# Altium project Babadustov_A_O_Курсовой.PrjPcb
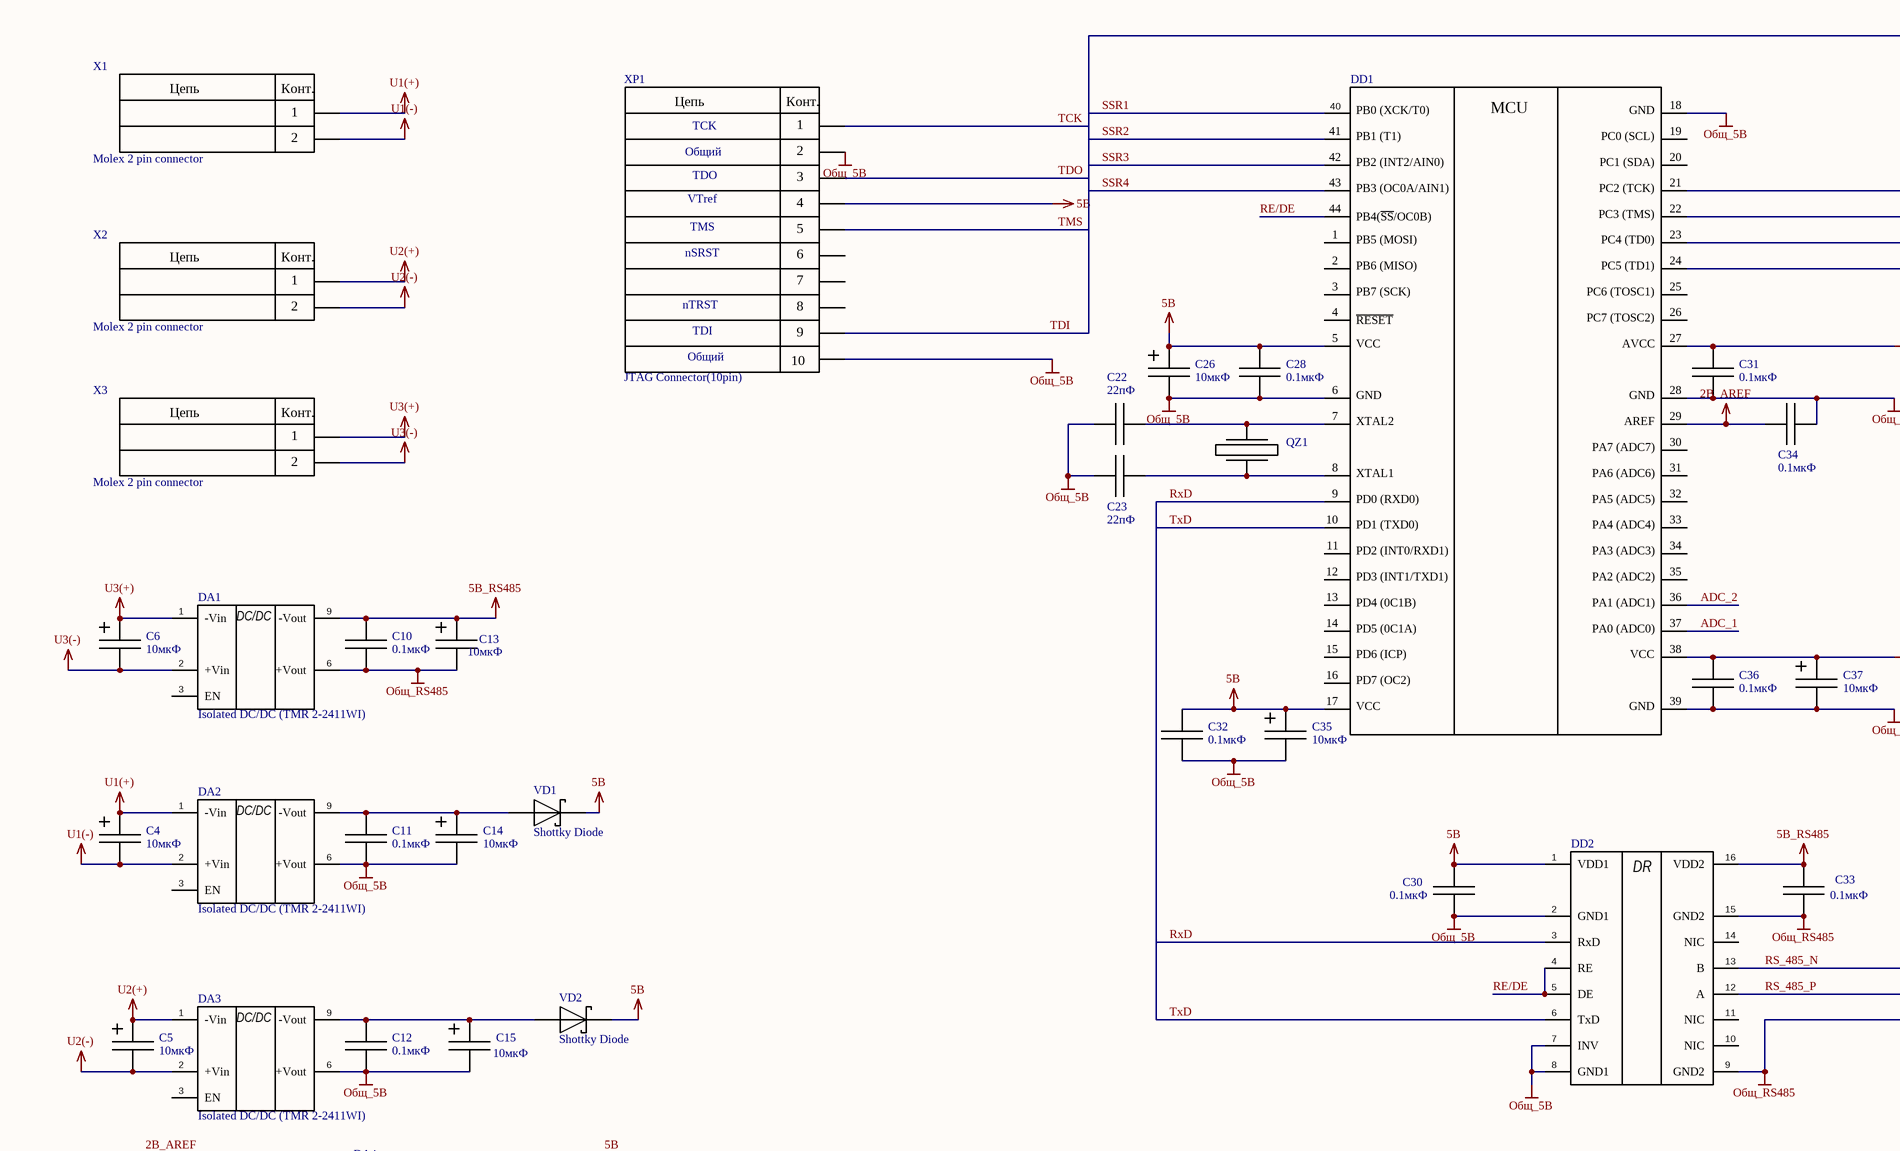
[diagram p0: Sheet1.SchDoc, top left]
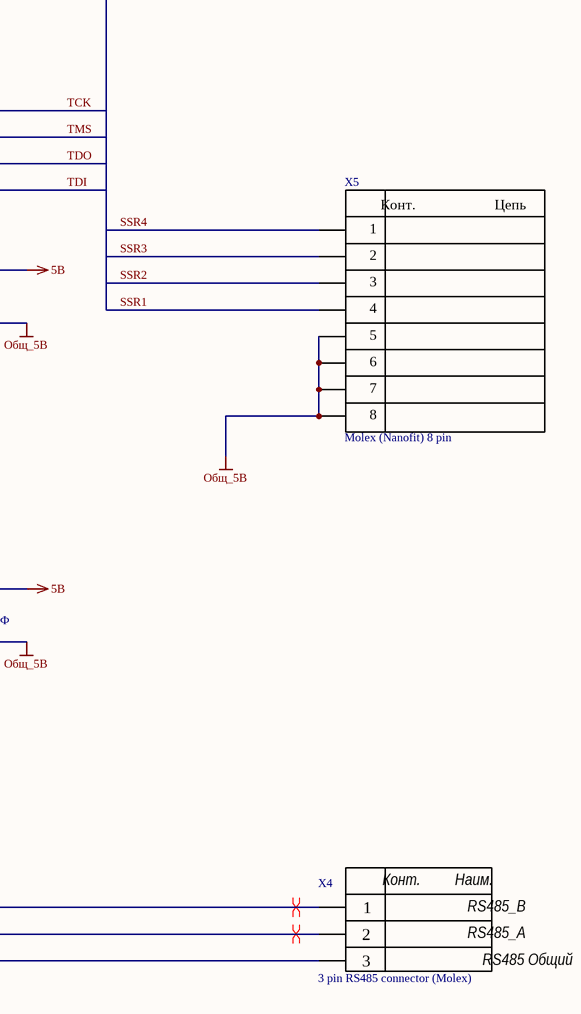
[diagram p1: Sheet1.SchDoc, top right]
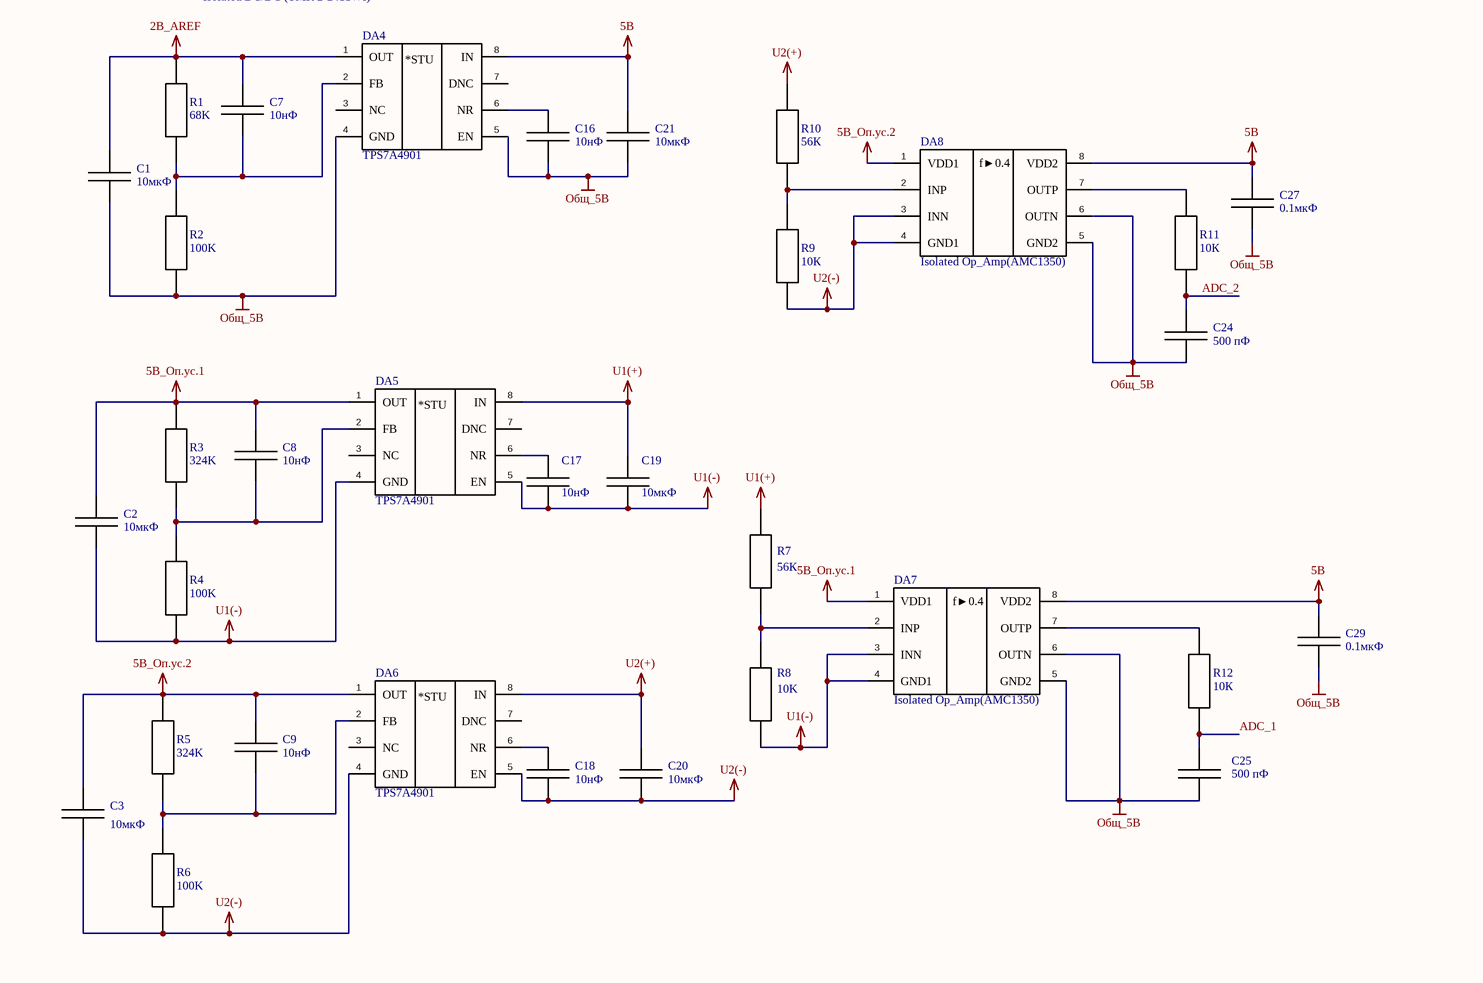
[diagram p2: Sheet1.SchDoc, bottom left]
1 sheet, 68 parts. Net scope: global (net labels, ports and power ports of the same name join across sheets).
Board file: PCB1.PcbDoc

## Sheet Sheet1.SchDoc
size 594 x 420 mm; SheetNumber: 1; SheetTotal: 1

### Parts
C1  CAP  [0805]  (value not drawn)
C2  CAP  [0805]  (value not drawn)
C3  CAP  [0805]  (value not drawn)
C4  CAP  [Cap pol 4x5.4]  (value not drawn)
C5  CAP  [Cap pol 4x5.4]  (value not drawn)
C6  CAP  [Cap pol 4x5.4]  (value not drawn)
C7  CAP  [0805]  (value not drawn)
C8  CAP  [0805]  (value not drawn)
C9  CAP  [0805]  (value not drawn)
C10  CAP  [0805]  (value not drawn)
C11  CAP  [0805]  (value not drawn)
C12  CAP  [0805]  (value not drawn)
C13  CAP  [Cap pol 4x5.4]  (value not drawn)
C14  CAP  [Cap pol 4x5.4]  (value not drawn)
C15  CAP  [Cap pol 4x5.4]  (value not drawn)
C16  CAP  [0805]  (value not drawn)
C17  CAP  [0805]  (value not drawn)
C18  CAP  [0805]  (value not drawn)
C19  CAP  [0805]  (value not drawn)
C20  CAP  [0805]  (value not drawn)
C21  CAP  [0805]  (value not drawn)
C22  CAP  [0805]  (value not drawn)
C23  CAP  [0805]  (value not drawn)
C24  CAP  [0805]  (value not drawn)
C25  CAP  [0805]  (value not drawn)
C26  CAP  [Cap pol 4x5.4]  (value not drawn)
C27  CAP  [0805]  (value not drawn)
C28  CAP  [0805]  (value not drawn)
C29  CAP  [0805]  (value not drawn)
C30  CAP  [0805]  (value not drawn)
C31  CAP  [0805]  (value not drawn)
C32  CAP  [0805]  (value not drawn)
C33  CAP  [0805]  (value not drawn)
C34  CAP  [0805]  (value not drawn)
C35  CAP  [Cap pol 4x5.4]  (value not drawn)
C36  CAP  [0805]  (value not drawn)
C37  CAP  [Cap pol 4x5.4]  (value not drawn)
DA1  Isolated DC/DC (TMR 2-2411WI)  [SIP-9]
DA2  Isolated DC/DC (TMR 2-2411WI)  [SIP-9]
DA3  Isolated DC/DC (TMR 2-2411WI)  [SIP-9]
DA4  TPS7A4901  [HVSSOP-8]
DA5  TPS7A4901  [HVSSOP-8]
DA6  TPS7A4901  [HVSSOP-8]
DA7  Isolated Op_Amp(AMC1350)  [SOIC-8]
DA8  Isolated Op_Amp(AMC1350)  [SOIC-8]
DD1  Atmega164PA  [TQFP-44]  (value not drawn)
DD2  Isolated RS485 Tranciever(ADM2461E)  [SSOP-16]  (value not drawn)
QZ1  Quartz rez  [XTAL]  (value not drawn)
R1  68K  [0805]
R2  100K  [0805]
R3  324K  [0805]
R4  100K  [0805]
R5  324K  [0805]
R6  100K  [0805]
R7  56К  [0805]
R8  10K  [0805]
R9  10К  [0805]
R10  56К  [0805]
R11  10К  [0805]
R12  10К  [0805]
VD1  Shottky Diode  [SMC]
VD2  Shottky Diode  [SMC]
X1  Molex 2 pin connector  [MolexMicroFit 2x1]
X2  Molex 2 pin connector  [MolexMicroFit 2x1]
X3  Molex 2 pin connector  [MolexMicroFit 2x1]
X4  3 pin RS485 connector (Molex)  [MolexMicroFit 3x1]
X5  Molex (Nanofit) 8 pin  [Molex Nanofit 8 pin]
XP1  JTAG Connector(10pin)  [PLD 10]

### Nets
2B_AREF: C1.1 C7.1 C34.2 DA4.1(OUT) DD1.29 R1.2
5В: C21.1 C26.2 C27.1 C28.1 C29.1 C30.1 C31.1 C32.1 C35.2 C36.1 C37.2 DA4.8(IN) DA7.8(VDD2) DA8.8(VDD2) DD1.5 DD1.17 DD1.27 DD1.38 DD2.1(VDD1) VD1.2 VD2.2 XP1.4
5В_RS485: C10.1 C13.2 C33.1 DA1.9(-Vout) DD2.16(VDD2)
5В_Оп.ус.1: C2.1 C8.1 DA5.1(OUT) DA7.1(VDD1) R3.2
5В_Оп.ус.2: C3.1 C9.1 DA6.1(OUT) DA8.1(VDD1) R5.2
U1(+): C4.2 C19.1 DA2.1(-Vin) DA5.8(IN) R7.2 X1.1
U1(-): C2.2 C4.1 C17.2 C19.2 DA2.2(+Vin) DA5.4(GND) DA5.5(EN) DA7.3(INN) DA7.4(GND1) R4.1 R8.1 X1.2
U2(+): C5.2 C20.1 DA3.1(-Vin) DA6.8(IN) R10.2 X2.1
U2(-): C3.2 C5.1 C18.2 C20.2 DA3.2(+Vin) DA6.4(GND) DA6.5(EN) DA8.3(INN) DA8.4(GND1) R6.1 R9.1 X2.2
U3(+): C6.2 DA1.1(-Vin) X3.1
U3(-): C6.1 DA1.2(+Vin) X3.2
Общ_5В: C1.2 C11.2 C12.2 C14.1 C15.1 C16.2 C21.2 C22.1 C23.1 C24.2 C25.2 C26.1 C27.2 C28.2 C29.2 C30.2 C31.2 C32.2 C34.1 C35.1 C36.2 C37.1 DA2.6(+Vout) DA3.6(+Vout) DA4.4(GND) DA4.5(EN) DA7.5(GND2) DA7.6(OUTN) DA8.5(GND2) DA8.6(OUTN) DD1.6 DD1.18 DD1.28 DD1.39 DD2.2(GND1) DD2.7(INV) DD2.8(GND1) R2.1 X5.5 X5.6 X5.7 X5.8 XP1.2 XP1.10
Общ_RS485: C10.2 C13.1 C33.2 DA1.6(+Vout) DD2.9(GND2) DD2.15(GND2) X4.3
ADC_1: C25.1 DD1.37 R12.1
ADC_2: C24.1 DD1.36 R11.1
RE/DE: DD1.44(PB4(~{SS}/OC0B)) DD2.4(RE) DD2.5(DE)
RS_485_N: DD2.13(B) X4.1
RS_485_P: DD2.12(A) X4.2
RxD: DD1.9 DD2.3(RxD)
SSR1: DD1.40 X5.4
SSR2: DD1.41 X5.3
SSR3: DD1.42 X5.2
SSR4: DD1.43 X5.1
TCK: DD1.21 XP1.1
TDI: DD1.24 XP1.9
TDO: DD1.23 XP1.3
TMS: DD1.22 XP1.5
TxD: DD1.10 DD2.6(TxD)
NetC7_2: C7.2 DA4.2(FB) R1.1 R2.2
NetC8_2: C8.2 DA5.2(FB) R3.1 R4.2
NetC9_2: C9.2 DA6.2(FB) R5.1 R6.2
NetC11_1: C11.1 C14.2 DA2.9(-Vout) VD1.1
NetC12_1: C12.1 C15.2 DA3.9(-Vout) VD2.1
NetC16_1: C16.1 DA4.6(NR)
NetC17_1: C17.1 DA5.6(NR)
NetC18_1: C18.1 DA6.6(NR)
NetC22_2: C22.2 DD1.7 QZ1.2
NetC23_2: C23.2 DD1.8 QZ1.1
NetDA7_2: DA7.2(INP) R7.1 R8.2
NetDA7_7: DA7.7(OUTP) R12.2
NetDA8_2: DA8.2(INP) R9.2 R10.1
NetDA8_7: DA8.7(OUTP) R11.2

Not connected (* = marked no-connect by the designer): DA1 3(EN); DA2 3(EN); DA3 3(EN); DA4 3(NC) 7(DNC); DA5 3(NC) 7(DNC); DA6 3(NC) 7(DNC); DD1 1 2 3 4(~{RESET}) 11 12 13 14 15 16 19 20 25 26 30 31 32 33 34 35; DD2 10(NIC) 11(NIC) 14(NIC); XP1 6 7 8

### Layout directives
differential pair; rule Differential Pairs Routing [Pref Gap = 0.254mm    Min Gap  = 0.254mm    Max Gap  = 0.254mmPref Width = 0.381mm    Min Width  = 0.381mm    Max Width  = 0.381mm]: RS_485_N, RS_485_P

### Notes on the sheet
- 10мкФ
- 0.1мкФ
- 22пФ
- (near C34) 0.1мкФ
- (near C23) 22пФ
- (near C13) 10мкФ
- (near C37) 10мкФ
- (near C30) 0.1мкФ
- (near C33) 0.1мкФ
- (near DA3) 10мкФ
- (near C15) 10мкФ
- (near C7) 10нФ
- 10нФ
- (near C21) 10мкФ
- (near C27) 0.1мкФ
- (near C24) 500 пФ
- (near C8) 10нФ
- (near C17) 10нФ
- (near C19) 10мкФ
- (near C29) 0.1мкФ
- (near C9) 10нФ
- (near C20) 10мкФ
- (near C25) 500 пФ
- Перв.примен.
- Справ.№
- Подп. и дата
- Инв.№ дубл.
- Взам.инв.№
- Подп.и дата
- Разраб.
- Изм.
- Лист
- № докум.
- Подп.
- Дата
- Лит.
- Масштаб
- Масса
- Т.контр.
- Пров.
- СХЕМА   ЭЛЕКТРИЧЕСКАЯ
- ПРИНЦИПИАЛЬНАЯ
- Листов
- Инв.№ подл.
- Утв.
- Н.контр.
- Нач.сект.
- Формат  A2
- (in symbol 3 pin RS485 connector (Molex)) Конт.; Наим.; RS485_B; RS485_A; RS485 Общий
- (in symbol Atmega164PA) PB0 (XCK/T0); MCU; GND; PB1 (T1); PC0 (SCL); PB2 (INT2/AIN0); PC1 (SDA); PB3 (OC0A/AIN1); PC2 (TCK); PC3 (TMS); PB5 (MOSI); PC4 (TD0); PB6 (MISO); PC5 (TD1); PB7 (SCK); PC6 (TOSC1); PC7 (TOSC2); VCC; AVCC; XTAL2; AREF; PA7 (ADC7); XTAL1; PA6 (ADC6); PD0 (RXD0); PA5 (ADC5); PD1 (TXD0); PA4 (ADC4); PD2 (INT0/RXD1); PA3 (ADC3); PD3 (INT1/TXD1); PA2 (ADC2); PD4 (0C1B); PA1 (ADC1); PD5 (0C1A); PA0 (ADC0); PD6 (ICP); PD7 (OC2)
- (in symbol Isolated DC/DC (TMR 2-2411WI)) DC/DC
- (in symbol Isolated Op_Amp(AMC1350)) f►0.4
- (in symbol Isolated RS485 Tranciever(ADM2461E)) DR
- (in symbol JTAG Connector(10pin)) Цепь; Конт.; TCK; Общий; TDO; VTref; TMS; nSRST; nTRST; TDI
- (in symbol LDO(TPS7A4901DGNR)) *STU
- (in symbol Molex 2 pin connector) Цепь; Конт.
- (in symbol Molex (Nanofit) 8 pin) Конт.; Цепь

### Library data of the parts
C4-C6 C13-C15 C26 C35 C37 = Cap Pol 10uF 16V: ECAP SMD,  16VV, 105°C
DA4-DA6 = LDO(TPS7A4901DGNR)
QZ1 = QZ: ComponentLink1Description: Chip&Dip; ComponentLink1URL: https://www.chipdip.ru/product0/8006373177
R1-R12 = Res
DD1 = Atmega164PA: ComponentLink1Description: Datasheet; ComponentLink1URL: https://static.chipdip.ru/lib/562/DOC011562915.pdf; ComponentLink2Description: Chip&Dip; ComponentLink2URL: https://www.chipdip.ru/product/atmega164pa-au?from=suggest_product
XP1 = JTAG Connector(10pin): ComponentLink1Description: CHIPDIP; ComponentLink1URL: https://www.chipdip.ru/product/pld-10